# Altium project 2_iip_rbf.PrjPCB
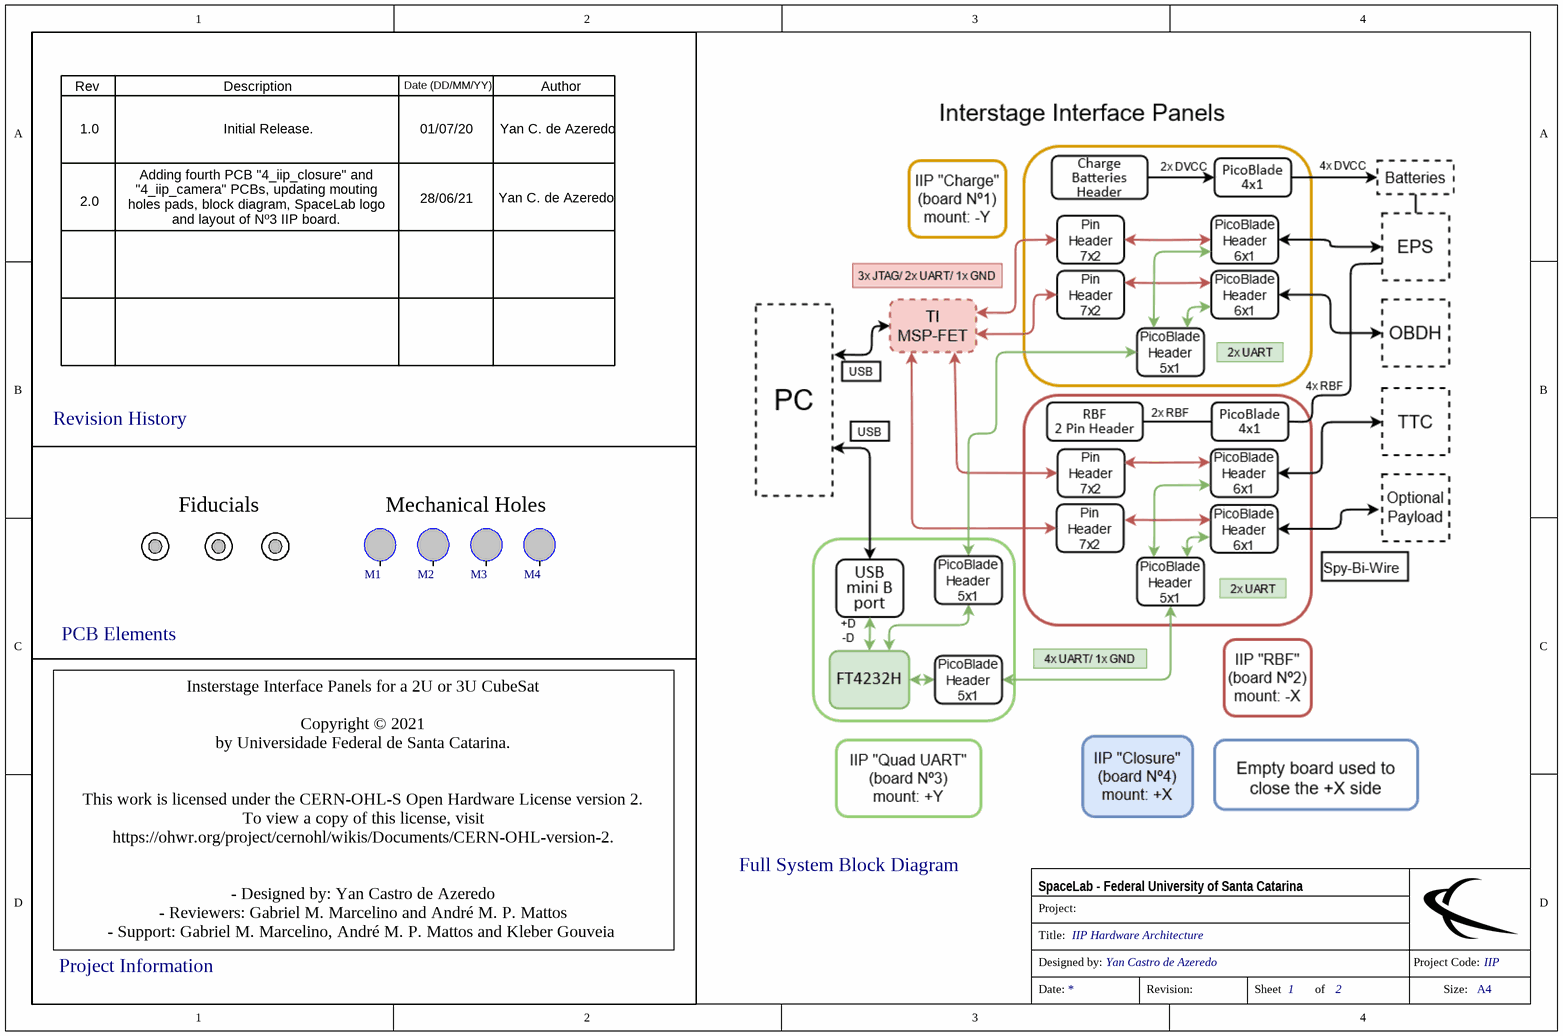
[diagram p0: 0_Architecture.SchDoc]
DesignedBy: Yan Castro de Azeredo; ProjectCode: IIPN2; ProjectRevision: 1.0
2 sheets, 16 parts. Net scope: global (net labels, ports and power ports of the same name join across sheets).
Board file: 2_iip_rbf.PcbDoc
Sheets:
  0_Architecture.SchDoc
  2_iip_rbf.SchDoc

## Sheet 0_Architecture.SchDoc: IIP Hardware Architecture
size A4; Address5: CEP: 88040 - 900; Organization: UFSC; DocumentNumber: 1; Revision: 1.0; SheetNumber: 1; SheetTotal: 2; ProjectCode: IIP

### Parts
FD1  Fiducial 1.3  [Fiducial 1.3mm]  (value not drawn)  (no BOM)
FD2  Fiducial 1.3  [Fiducial 1.3mm]  (value not drawn)  (no BOM)
FD3  Fiducial 1.3  [Fiducial 1.3mm]  (value not drawn)  (no BOM)
M1  IB Mechanical Hole  [M3 hole (5.5mm pad)]  (value not drawn)  (no BOM)
M2  IB Mechanical Hole  [M3 hole (5.5mm pad)]  (value not drawn)  (no BOM)
M3  IB Mechanical Hole  [M3 hole (5.5mm pad)]  (value not drawn)  (no BOM)
M4  IB Mechanical Hole  [M3 hole (5.5mm pad)]  (value not drawn)  (no BOM)

### Nets

Not connected (* = marked no-connect by the designer): M1 0; M2 0; M3 0; M4 0

### Notes on the sheet
- Rev
- Description
- Date (DD/MM/YY)
- Author
- 1.0
- Initial Release.
- 01/07/20
- Yan C. de Azeredo
- 2.0
- Adding fourth PCB "4_iip_closure" and "4_iip_camera" PCBs, updating mouting holes pads, block diagram, SpaceLab logo and layout of Nº3 IIP board.
- 28/06/21
- Revision History
- Fiducials
- Mechanical Holes
- PCB Elements
- Full System Block Diagram
- Insterstage Interface Panels for a 2U or 3U CubeSat
  Copyright © 2021
  by Universidade Federal de Santa Catarina.
  This work is licensed under the CERN-OHL-S Open Hardware License version 2.
  To view a copy of this license, visit https://ohwr.org/project/cernohl/wikis/Documents/CERN-OHL-version-2.
  - Designed by: Yan Castro de Azeredo
  - Reviewers: Gabriel M. Marcelino and André M. P. Mattos
  - Support: Gabriel M. Marcelino, André M. P. Mattos and Kleber Gouveia
  - Mechanical validation: Edemar M. Filho and Caique S. M. Gomes
- Project Information
- Project:
- SpaceLab - Federal University of Santa Catarina
- Title:
- Designed by:
- Project Code:
- Date:
- Revision:
- Sheet
- of
- Size:
- A4

### Library data of the parts
FD1-FD3 = Fiducial 1.3: Fiducial 1.3mm
M1-M4 = IB Mechanical Hole: Mechanical Hole for FloripaSat-2 interface boards

## Sheet 2_iip_rbf.SchDoc: IIP N2 RBF Interfaces
size A4; Address5: CEP: 88040 - 900; Organization: UFSC; DocumentNumber: 2; Revision: 1.0; SheetNumber: 2; SheetTotal: 2; ProjectCode: IIPN2
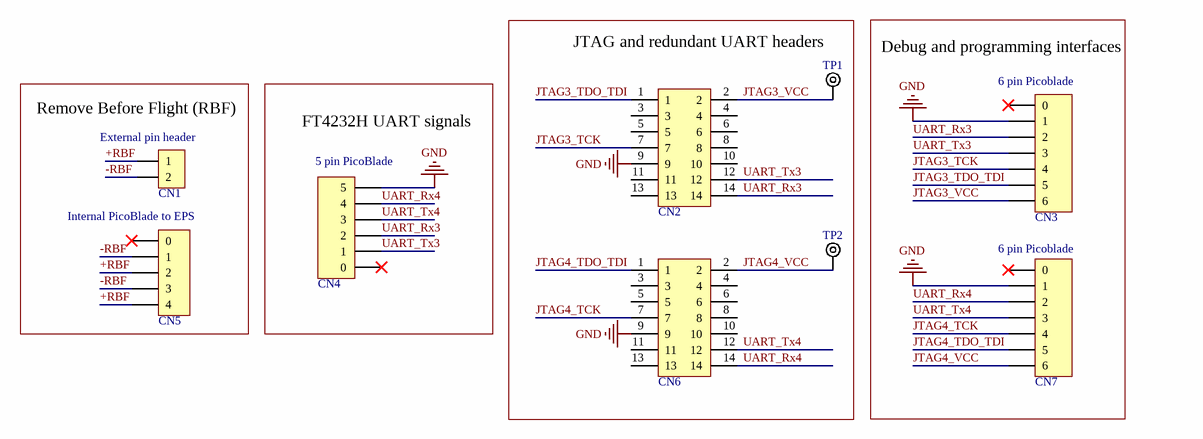
[diagram p1: 2_iip_rbf.SchDoc]

### Parts
CN1  2 POS Pin Header  [CONN HEADER VERT 2POS 2.54mm]  (value not drawn)
CN2  7 POS dual line Pin Header 2.54mm  [CONN HEADER VERT 14POS 2.54MM]  (value not drawn)
CN3  6 pin Picoblade  [PICO BLADE 0533980671]
CN4  5 pin PicoBlade  [PICO BLADE 0533980571]
CN5  4 pin Picoblade  [PICO BLADE 0533980471]  (value not drawn)
CN6  7 POS dual line Pin Header 2.54mm  [CONN HEADER VERT 14POS 2.54MM]  (value not drawn)
CN7  6 pin Picoblade  [PICO BLADE 0533980671]
TP1  DNP  [TEST POINT PTH]  (value not drawn)  (no BOM)
TP2  DNP  [TEST POINT PTH]  (value not drawn)  (no BOM)

### Blocks framed on the sheet
JTAG and redundant UART headers: CN2 CN6 TP1 TP2
Debug and programming interfaces: CN3 CN7
Remove Before Flight (RBF): CN1 CN5
FT4232H UART signals: CN4

### Nets
GND: CN2.9 CN3.1 CN4.5 CN6.9 CN7.1
+RBF: CN1.1 CN5.2 CN5.4
-RBF: CN1.2 CN5.1 CN5.3
JTAG3_TCK: CN2.7 CN3.4
JTAG3_TDO_TDI: CN2.1 CN3.5
JTAG3_VCC: CN2.2 CN3.6 TP1.1
JTAG4_TCK: CN6.7 CN7.4
JTAG4_TDO_TDI: CN6.1 CN7.5
JTAG4_VCC: CN6.2 CN7.6 TP2.1
UART_Rx3: CN2.14 CN3.2 CN4.2
UART_Rx4: CN4.4 CN6.14 CN7.2
UART_Tx3: CN2.12 CN3.3 CN4.1
UART_Tx4: CN4.3 CN6.12 CN7.3

Not connected (* = marked no-connect by the designer): CN2 3 4 5 6 8 10 11 13; CN3 0*; CN4 0*; CN5 0*; CN6 3 4 5 6 8 10 11 13; CN7 0*

### Notes on the sheet
- (near CN1) External pin header
- (near CN5) Internal PicoBlade to EPS
- Project:
- SpaceLab - Federal University of Santa Catarina
- Title:
- Designed by:
- Project Code:
- Date:
- Revision:
- Sheet
- of
- Size:
- A4

### Library data of the parts
CN1 = M20-9990245: M20 HDR, PIN, SIL, VERT, 2W; Manufacturer: Harwin; Number of Contacts: 2; Current Rating: 3A; Contact Resistance: 25mR; Mating Cycles: 300; Voltage Rating (AC): 750V; Insulation Resistance: 10GR; Gender: Male; Connector Type: Male Pin; Voltage: 50V; Pitch: 2.54mm; Supplier 1: Digi-Key; Supplier Part Number 1: 952-2261-ND; Stock 1: 27298; Pricing 1: 1=0.15, 10=0.136, 100=0.0841, 500=0.0696, 1000=0.0609, 5000=0.0522, 10000=0.05075 (USD); Mount: Through Hole; Case/Package: SIL; Weight: 0.25lb; Contact Plating: Gold; Contact Material: Brass,Bronze; Color: Black; Housing Color: Black; Housing Material: Nylon; Min Operating Temperature: -40°C; Max Operating Temperature: 105°C; Number of Rows: 1; Termination: Solder; Max Current Rating: 3A; Number of Poles: 2; Package Quantity: 1000; Packaging: Bag; Number of Positions: 2; Working Voltage: 750V; Orientation: Straight; Current: 3A; Length: 5.08mm; Height: 0.12inch; Lead Pitch: 2.54mm; Width: 0.25inch; Contact Mating Length: 0.24inch; Depth: 2.54mm; Radiation Hardening: No; REACH SVHC: No SVHC; ComponentLink1URL: http://www.farnell.com/datasheets/2368211.pdf?src-supplier=Element14; ComponentLink1Description: http://www.farnell.com/datasheets/2368211.pdf?src-supplier=Element14; ComponentLink2URL: http://uk.rs-online.com/webdocs/1388/0900766b81388728.pdf?src-supplier=RSComponents; ComponentLink2Description: http://uk.rs-online.com/webdocs/1388/0900766b81388728.pdf?src-supplier=RSComponents; ComponentLink3URL: https://cdn.harwin.com/pdfs/Harwin_PC_Connectors_M20.pdf?src-supplier=Digi-Key; ComponentLink3Description: https://cdn.harwin.com/pdfs/Harwin_PC_Connectors_M20.pdf?src-supplier=Digi-Key; ComponentLink4URL: http://www.mouser.com/ds/2/181/Harwin_Product_Catalog_page_206-1134556.pdf?src-supplier=Mouser; ComponentLink4Description: http://www.mouser.com/ds/2/181/Harwin_Product_Catalog_page_206-1134556.pdf?src-supplier=Mouser; Supplier 2: Mouser; Supplier Part Number 2: 855-M20-9990245; Stock 2: 26881; Pricing 2: 1=0.14, 10=0.083, 100=0.069, 1000=0.06, 2000=0.052, 10000=0.05 (USD); Manufacturer Part Number: M20-9990245
CN2 CN6 = M20-9980745: Headers & Wire Housings 07+07 DIL VERTICAL PIN HEADER GOLD HT; Manufacturer: Harwin; Number of Contacts: 14; Contact Resistance: 25mR; Max Current Rating: 3A; Gender: Male; Connector Type: Male Pin; Row Spacing: 0.1inch; Supplier 1: Digi-Key; Supplier Part Number 1: 952-1932-ND; Stock 1: 15564; Pricing 1: 1=0.54, 10=0.51, 100=0.391, 500=0.34, 1000=0.2805, 5000=0.2465, 10000=0.2295 (USD); Mount: Through Hole; Contact Plating: Gold; Contact Material: Brass; Color: Black; Housing Color: Black; Housing Material: Nylon; Min Operating Temperature: -40°C; Max Operating Temperature: 105°C; Number of Rows: 2; Termination: Solder; Package Quantity: 500; Packaging: Bag; Number of Positions: 14; Orientation: Straight; Length: 17.78mm; Pitch: 2.54mm; Contact Mating Length: 0.24inch; Depth: 5.08mm; Radiation Hardening: No; REACH SVHC: No SVHC; ComponentLink1URL: https://www.verical.com/server-webapp/html/getDatasheet?partID=468550&src-supplier=Verical; ComponentLink1Description: https://www.verical.com/server-webapp/html/getDatasheet?partID=468550&src-supplier=Verical; ComponentLink2URL: http://www.harwin.com/include/downloads/drawings/M20-998.PDF?src-supplier=Element14; ComponentLink2Description: http://www.harwin.com/include/downloads/drawings/M20-998.PDF?src-supplier=Element14; ComponentLink3URL: http://www.mouser.com/ds/2/181/M20-998-351176.pdf?src-supplier=Mouser; ComponentLink3Description: http://www.mouser.com/ds/2/181/M20-998-351176.pdf?src-supplier=Mouser; Supplier 2: Mouser; Supplier Part Number 2: 855-M20-9980745; Stock 2: 1790; Pricing 2: 1=0.54, 10=0.51, 100=0.387, 500=0.34, 1000=0.28, 2500=0.246 (USD); Manufacturer Part Number: M20-9980745
CN3 CN7 = 53398-0671: 1.25mm Pitch PicoBlade™ Header, Surface Mount, Vertical, 6 Circuits; Manufacturer: Molex; Body Plating: Tin; Contact Resistance: 20mR; Voltage Rating: 125V; Current Rating: 1A; Number of Positions: 6; Insulation Resistance: 100MR; Gender: Male; Glow Wire Compliant: Non-compliant; Supplier 1: Digi-Key; Supplier Part Number 1: WM7610DKR-ND; Stock 1: 21086; Pricing 1: 1=1.39, 10=1.26, 100=1.0802, 500=0.90014 (USD); Mount: Surface Mount; Color: Natural; Contact Plating: Tin; Contact Material: Bronze,Tin; Housing Color: Natural; Housing Material: Nylon; Min Operating Temperature: -40°C; Max Operating Temperature: 85°C; Packaging: Tape and Reel; Number of Rows: 1; Voltage Rating (AC): 125V; Package Quantity: 1000; Termination: Solder; Number of Contacts: 6; Working Voltage: 125V; Orientation: Vertical; Number of Circuits: 6; Voltage Rating (DC): 125V; Lead Pitch: 1.25mm; Pitch: 1.25mm; Radiation Hardening: No; REACH SVHC: Unknown; Lead Free: Lead Free; Flammability Rating: UL94 V-0; ComponentLink1URL: https://www.molex.com/pdm_docs/sd/533980671_sd.pdf?src-supplier=Digi-Key; ComponentLink1Description: https://www.molex.com/pdm_docs/sd/533980671_sd.pdf?src-supplier=Digi-Key; Supplier 2: Mouser; Supplier Part Number 2: 538-53398-0671; Stock 2: 26; Pricing 2: 1=1.15, 10=1.01, 100=0.864, 500=0.727, 1000=0.427, 2000=0.374 (USD); Manufacturer Part Number: 53398-0671
CN4 = 53398-0571: Wire-To-Board Connector, Vertical, PicoBlade 53398 Series, Surface Mount, Header, 5, 1.25 mm; Manufacturer: Molex; Body Plating: Tin; Current Rating: 1A; Voltage Rating (AC): 125V; Contact Resistance: 20mR; Number of Positions: 5; Insulation Resistance: 100MR; Gender: Male; Pitch: 1.25mm; Glow Wire Compliant: Non-compliant; Supplier 1: Digi-Key; Supplier Part Number 1: WM7609CT-ND; Stock 1: 427; Pricing 1: 1=1.32, 10=1.159, 100=0.9999, 500=0.81814 (USD); Mount: Surface Mount; Contact Plating: Tin; Color: Natural; Contact Material: Bronze,Tin,Brass; Housing Color: Natural; Housing Material: Nylon; Min Operating Temperature: -40°C; Max Operating Temperature: 85°C; Packaging: Tape and Reel; Orientation: Vertical; Number of Rows: 1; Voltage Rating: 125V; Max Voltage Rating (AC): 125V; Package Quantity: 1000; Contact Gender: Male; Termination: Solder; Number of Contacts: 5; Working Voltage: 125V; Number of Circuits: 5; Voltage Rating (DC): 125V; Lead Pitch: 1.25mm; Radiation Hardening: No; Flammability Rating: UL94 V-0; REACH SVHC: Unknown; Lead Free: Lead Free; ComponentLink1URL: http://www.molex.com/webdocs/datasheets/pdf/en-us/0533980571_PCB_HEADERS.pdf?src-supplier=Avnet+Europe; ComponentLink1Description: http://www.molex.com/webdocs/datasheets/pdf/en-us/0533980571_PCB_HEADERS.pdf?src-supplier=Avnet+Europe; ComponentLink2URL: http://www.farnell.com/datasheets/2697810.pdf?src-supplier=Newark; ComponentLink2Description: http://www.farnell.com/datasheets/2697810.pdf?src-supplier=Newark; ComponentLink3URL: https://www.distrelec.biz/Web/Downloads/46/_e/gf116833-116846_e.pdf?mime=application%2Fpdf&src-supplier=Distrelec; ComponentLink3Description: https://www.distrelec.biz/Web/Downloads/46/_e/gf116833-116846_e.pdf?mime=application%2Fpdf&src-supplier=Distrelec; ComponentLink4URL: http://www.farnell.com/datasheets/1632115.pdf?src-supplier=Element14; ComponentLink4Description: http://www.farnell.com/datasheets/1632115.pdf?src-supplier=Element14; ComponentLink5URL: http://uk.rs-online.com/webdocs/078f/0900766b8078fc92.pdf?src-supplier=RSComponents; ComponentLink5Description: http://uk.rs-online.com/webdocs/078f/0900766b8078fc92.pdf?src-supplier=RSComponents; ComponentLink6URL: http://www.farnell.com/datasheets/1867377.pdf?src-supplier=Element14; ComponentLink6Description: http://www.farnell.com/datasheets/1867377.pdf?src-supplier=Element14; ComponentLink7URL: http://www.farnell.com/datasheets/1626108.pdf?src-supplier=Element14; ComponentLink7Description: http://www.farnell.com/datasheets/1626108.pdf?src-supplier=Element14; ComponentLink8URL: http://www.mouser.com/ds/2/276/0533980571_PCB_HEADERS-146486.pdf?src-supplier=Mouser; ComponentLink8Description: http://www.mouser.com/ds/2/276/0533980571_PCB_HEADERS-146486.pdf?src-supplier=Mouser; Supplier 2: Mouser; Supplier Part Number 2: 538-53398-0571; Stock 2: 35606; Pricing 2: 1=1.32, 10=1.15, 100=0.999, 500=0.818, 1000=0.389, 2000=0.342 (USD); Manufacturer Part Number: 53398-0571
CN5 = 0533980471: Connector Header Surface Mount 4 position 0.049" (1.25mm); Manufacturer: Molex; Manufacturer Part Number: 53398-0471; N of Positions: 4; Body Plating: Tin; Contact Resistance: 20mR; Current Rating: 1A; Gender: Male; Glow Wire Compliant: Non-compliant; Insulation Resistance: 100MR; Voltage Rating (AC): 125V; Pitch: 1.25mm; Mount Type: SMD; Value: 0533980471; Color: Natural; ComponentLink1Description: http://www.mouser.com/ds/2/276/0533980471_PCB_HEADERS-171069.pdf?src-supplier=Mouser; ComponentLink1URL: http://www.mouser.com/ds/2/276/0533980471_PCB_HEADERS-171069.pdf?src-supplier=Mouser; ComponentLink2Description: http://www.jameco.com/Jameco/Products/ProdDS/1932627.pdf?src-supplier=Jameco; ComponentLink2URL: http://www.jameco.com/Jameco/Products/ProdDS/1932627.pdf?src-supplier=Jameco; ComponentLink3Description: https://www.distrelec.biz/Web/Downloads/46/_e/gf116833-116846_e.pdf?mime=application%2Fpdf&src-supplier=Distrelec; ComponentLink3URL: https://www.distrelec.biz/Web/Downloads/46/_e/gf116833-116846_e.pdf?mime=application%2Fpdf&src-supplier=Distrelec; ComponentLink4Description: http://www.molex.com/webdocs/datasheets/pdf/en-us/0533980471_PCB_HEADERS.pdf?src-supplier=Element14; ComponentLink4URL: http://www.molex.com/webdocs/datasheets/pdf/en-us/0533980471_PCB_HEADERS.pdf?src-supplier=Element14; ComponentLink5Description: http://www.farnell.com/datasheets/1867381.pdf?src-supplier=Element14; ComponentLink5URL: http://www.farnell.com/datasheets/1867381.pdf?src-supplier=Element14; ComponentLink6Description: http://uk.rs-online.com/webdocs/13c4/0900766b813c4500.pdf?src-supplier=RSComponents; ComponentLink6URL: http://uk.rs-online.com/webdocs/13c4/0900766b813c4500.pdf?src-supplier=RSComponents; ComponentLink7Description: http://www.molex.com/webdocs/datasheets/pdf/en-us/0533980471_PCB_HEADERS.pdf?src-supplier=Farnell; ComponentLink7URL: http://www.molex.com/webdocs/datasheets/pdf/en-us/0533980471_PCB_HEADERS.pdf?src-supplier=Farnell; ComponentLink8Description: http://www.farnell.com/datasheets/2697809.pdf?src-supplier=Element14; ComponentLink8URL: http://www.farnell.com/datasheets/2697809.pdf?src-supplier=Element14; ComponentLink9Description: http://www.molex.com/webdocs/datasheets/pdf/en-us/0533980471_PCB_HEADERS.pdf?src-supplier=Avnet; ComponentLink9URL: http://www.molex.com/webdocs/datasheets/pdf/en-us/0533980471_PCB_HEADERS.pdf?src-supplier=Avnet; ComponentLink10Description: http://www.molex.com/webdocs/datasheets/pdf/en-us/0533980471_PCB_HEADERS.pdf?src-supplier=Avnet+Europe; ComponentLink10URL: http://www.molex.com/webdocs/datasheets/pdf/en-us/0533980471_PCB_HEADERS.pdf?src-supplier=Avnet+Europe; Contact Material: Bronze,Tin,Brass; Contact Plating: Tin; Flammability Rating: UL94 V-0; Housing Color: Natural; Housing Material: Nylon; Lead Free: Lead Free; Lead Pitch: 1.25mm; Max Operating Temperature: 85°C; Min Operating Temperature: -40°C; Mount: Surface Mount; Number of Circuits: 4; Number of Contacts: 4; Number of Positions: 4; Number of Rows: 1; Orientation: Vertical; Package Quantity: 1000; Packaging: Tape and Reel; Pricing 1: 1=1.19, 10=1.044, 100=0.901, 500=0.73716 (USD); Pricing 2: 1=0.98, 10=0.832, 100=0.716, 500=0.6, 1000=0.391, 2000=0.342 (USD); Radiation Hardening: No; REACH SVHC: Unknown; Stock 1: 21236; Stock 2: 43680; Supplier 1: Digi-Key; Supplier 2: Mouser; Supplier Part Number 1: WM7608CT-ND; Supplier Part Number 2: 538-53398-0471; Termination: Solder; Voltage Rating (DC): 125V; Voltage Rating: 125V; Working Voltage: 125V
TP1 TP2 = Test Point PTH: TEST POINT PAD